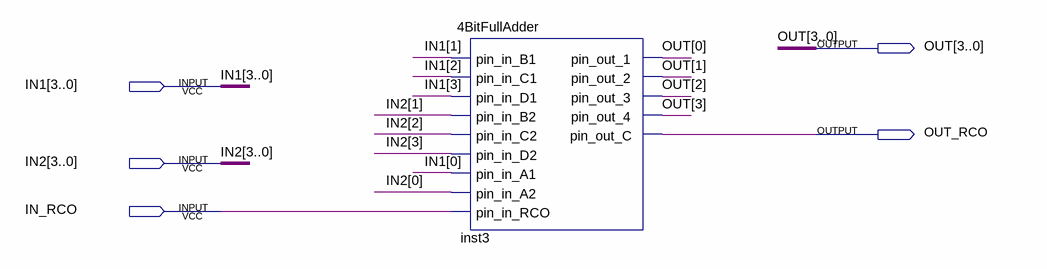
[diagram p0: schematic sheet]
// Quartus schematic 4BitFullAdderUltra.bdf as structural Verilog: 1 symbols, 5 pins
module \4BitFullAdderUltra  (
  input  [3:0] IN1,
  input  [3:0] IN2,
  input  IN_RCO,
  output [3:0] OUT,
  output OUT_RCO
);

  \4BitFullAdder  inst3 (
    .pin_in_B1(IN1[1]), .pin_in_C1(IN1[2]), .pin_in_D1(IN1[3]), .pin_in_B2(IN2[1]), .pin_in_C2(IN2[2]),
    .pin_in_D2(IN2[3]), .pin_in_A1(IN1[0]), .pin_in_A2(IN2[0]), .pin_in_RCO(IN_RCO), .pin_out_1(OUT[0]),
    .pin_out_2(OUT[1]), .pin_out_3(OUT[2]), .pin_out_4(OUT[3]), .pin_out_C(OUT_RCO));
endmodule
